# Altium schematic sheet Sheet2.SCHDOC
size 619 x 449 mm; SheetNumber: 2; SheetTotal: 2; DocumentName: Sheet2.SCHDOC
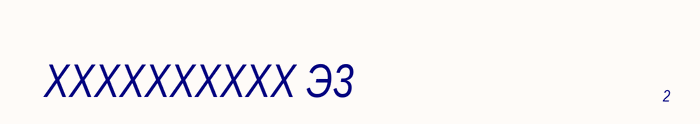
[diagram p0: Sheet2.SCHDOC]

## Notes on the sheet
- XXXXXXXXXX Э3
- 2
- Подп. и дата
- Инв. № дубл.
- Взамен инв. №
- Инв. № подл.
- Лист
- Изм.
- № докум.
- Подпись
- Дата
- Копировал
- Формат А3